# Altium schematic sheet Коммутация.SchDoc
size 209 x 297 mm; ApprovedBy: Утвердил; CheckedBy: Проверил; Author: Разработал; DrawnBy: Н.Контр; Engineer: Т.Контр; Organization: Организация; Address1: 2436.181092.5167; DocumentNumber: 3; SheetNumber: 3; SheetTotal: 3; PageSetup: Record=PageOptions|CenterHorizontal=True|CenterVertical=True|PrintScale=0.94|XCorrection=1.00|YCorrection=1.00|PrintKind=1|BorderSize=5000000|LeftOffset=0|BottomOffset=0|Orientation=1|PaperLength=1000|PaperWidth=1000|Scale=100|PaperSource=7|PrintQuality=-4|MediaType=1|DitherType=10|PaperKind=A4|PrintScaleMode=1; HeadOfSector: Нач. сектора; MainDevice: Перв.примен.; Name: Наименование; Name1: Наименование1; Scale: 1:1; DocumentName: Sheet1.SCHDOC
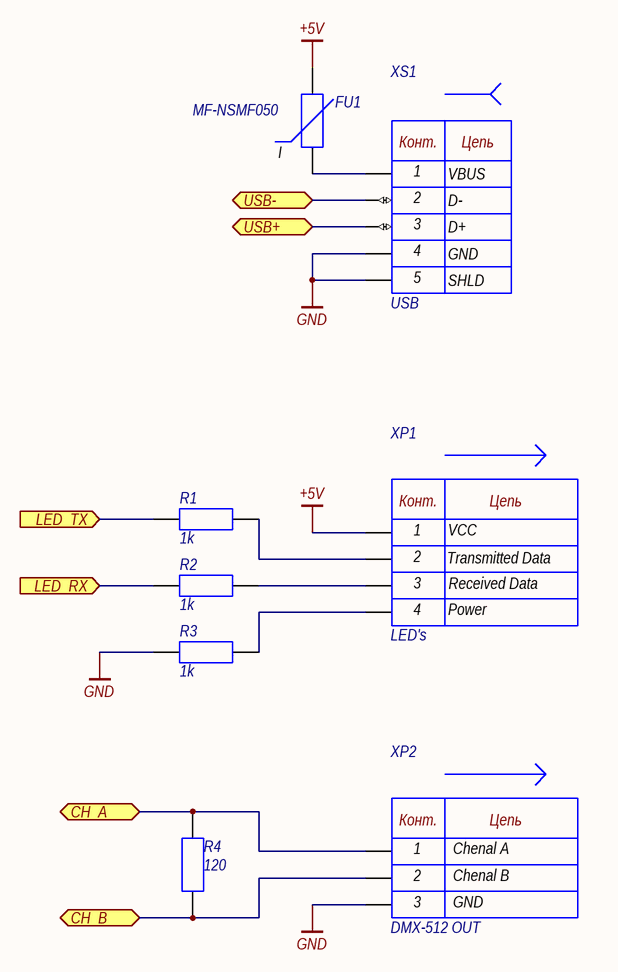
[diagram p0: Коммутация.SchDoc]

## Parts
FU1  value MF-NSMF050  [F1206 Style1]  (hidden comment: MF-NSMF050_V)
R1  value 1k  [R1206]  (hidden comment: Res 1k)
R2  value 1k  [R1206]  (hidden comment: Res 1k)
R3  value 1k  [R1206]  (hidden comment: Res 1k)
R4  value 120  [R1206]  (hidden comment: Res 120)
XP1  value LED's  [WF-4 (DS1070-4M)]  (hidden comment: WF-4)
XP2  value DMX-512 OUT  [WF-3]  (hidden comment: WF-3)
XS1  value USB  [USB-B]  (hidden comment: USB B)

## Ports
CH_A (bidir), CH_B (bidir), LED_RX (in), LED_TX (in), USB+ (bidir), USB- (bidir)

## Nets
+5V: FU1.2 XP1.1
GND: R3.1 XP2.3 XS1.4(GND) XS1.MH1(SHLD)
CH_A: R4.2 XP2.1 ; port CH_A
CH_B: R4.1 XP2.2 ; port CH_B
LED_RX: R2.1 ; port LED_RX
LED_TX: R1.1 ; port LED_TX
USB+: XS1.3(D+) ; port USB+
USB-: XS1.2(D-) ; port USB-
NetFU1_1: FU1.1 XS1.1(VBUS)
NetR1_2: R1.2 XP1.2
NetR2_2: R2.2 XP1.3
NetR3_2: R3.2 XP1.4

## Notes on the sheet
- Transmitted Data
- VCC
- Received Data
- Power
- Chenal A
- GND
- Chenal B
- Подп. и дата
- Инв.№ дубл.
- Взам.инв.№
- Подп.и дата
- Инв.№ подл.
- Изм.
- Лист
- № докум.
- Подп.
- Дата
- Копировал
- Формат  A4
- (in symbol MF-NSMF050_V) I
- (in symbol USB B) Конт.; Цепь; 5
- (in symbol WF-3) Конт.; Цепь
- (in symbol WF-4) Конт.; Цепь

## Library data of the parts
FU1 = MF-NSMF050_V: 13.2V 0.5A; Type: Предохранитель
XP1 = WF-4: Power Con (DS1070-4M); Type: Разъем
XP2 = WF-3: Power Con (DS1070-4M); Type: Разъем
XS1 = USB B: Female B; Type: Разъем
R1-R3 = Res 1k: Type: Резистор
R4 = Res 120: Type: Резистор